# EasyEDA schematic EasyEDA_Circuit_and_PCB.json
TITLE: Charge pump detector for MACH3; REV: 1.0; Date: 2020-06-17; Sheet: 1/1; Drawn By: lukas.kaplan
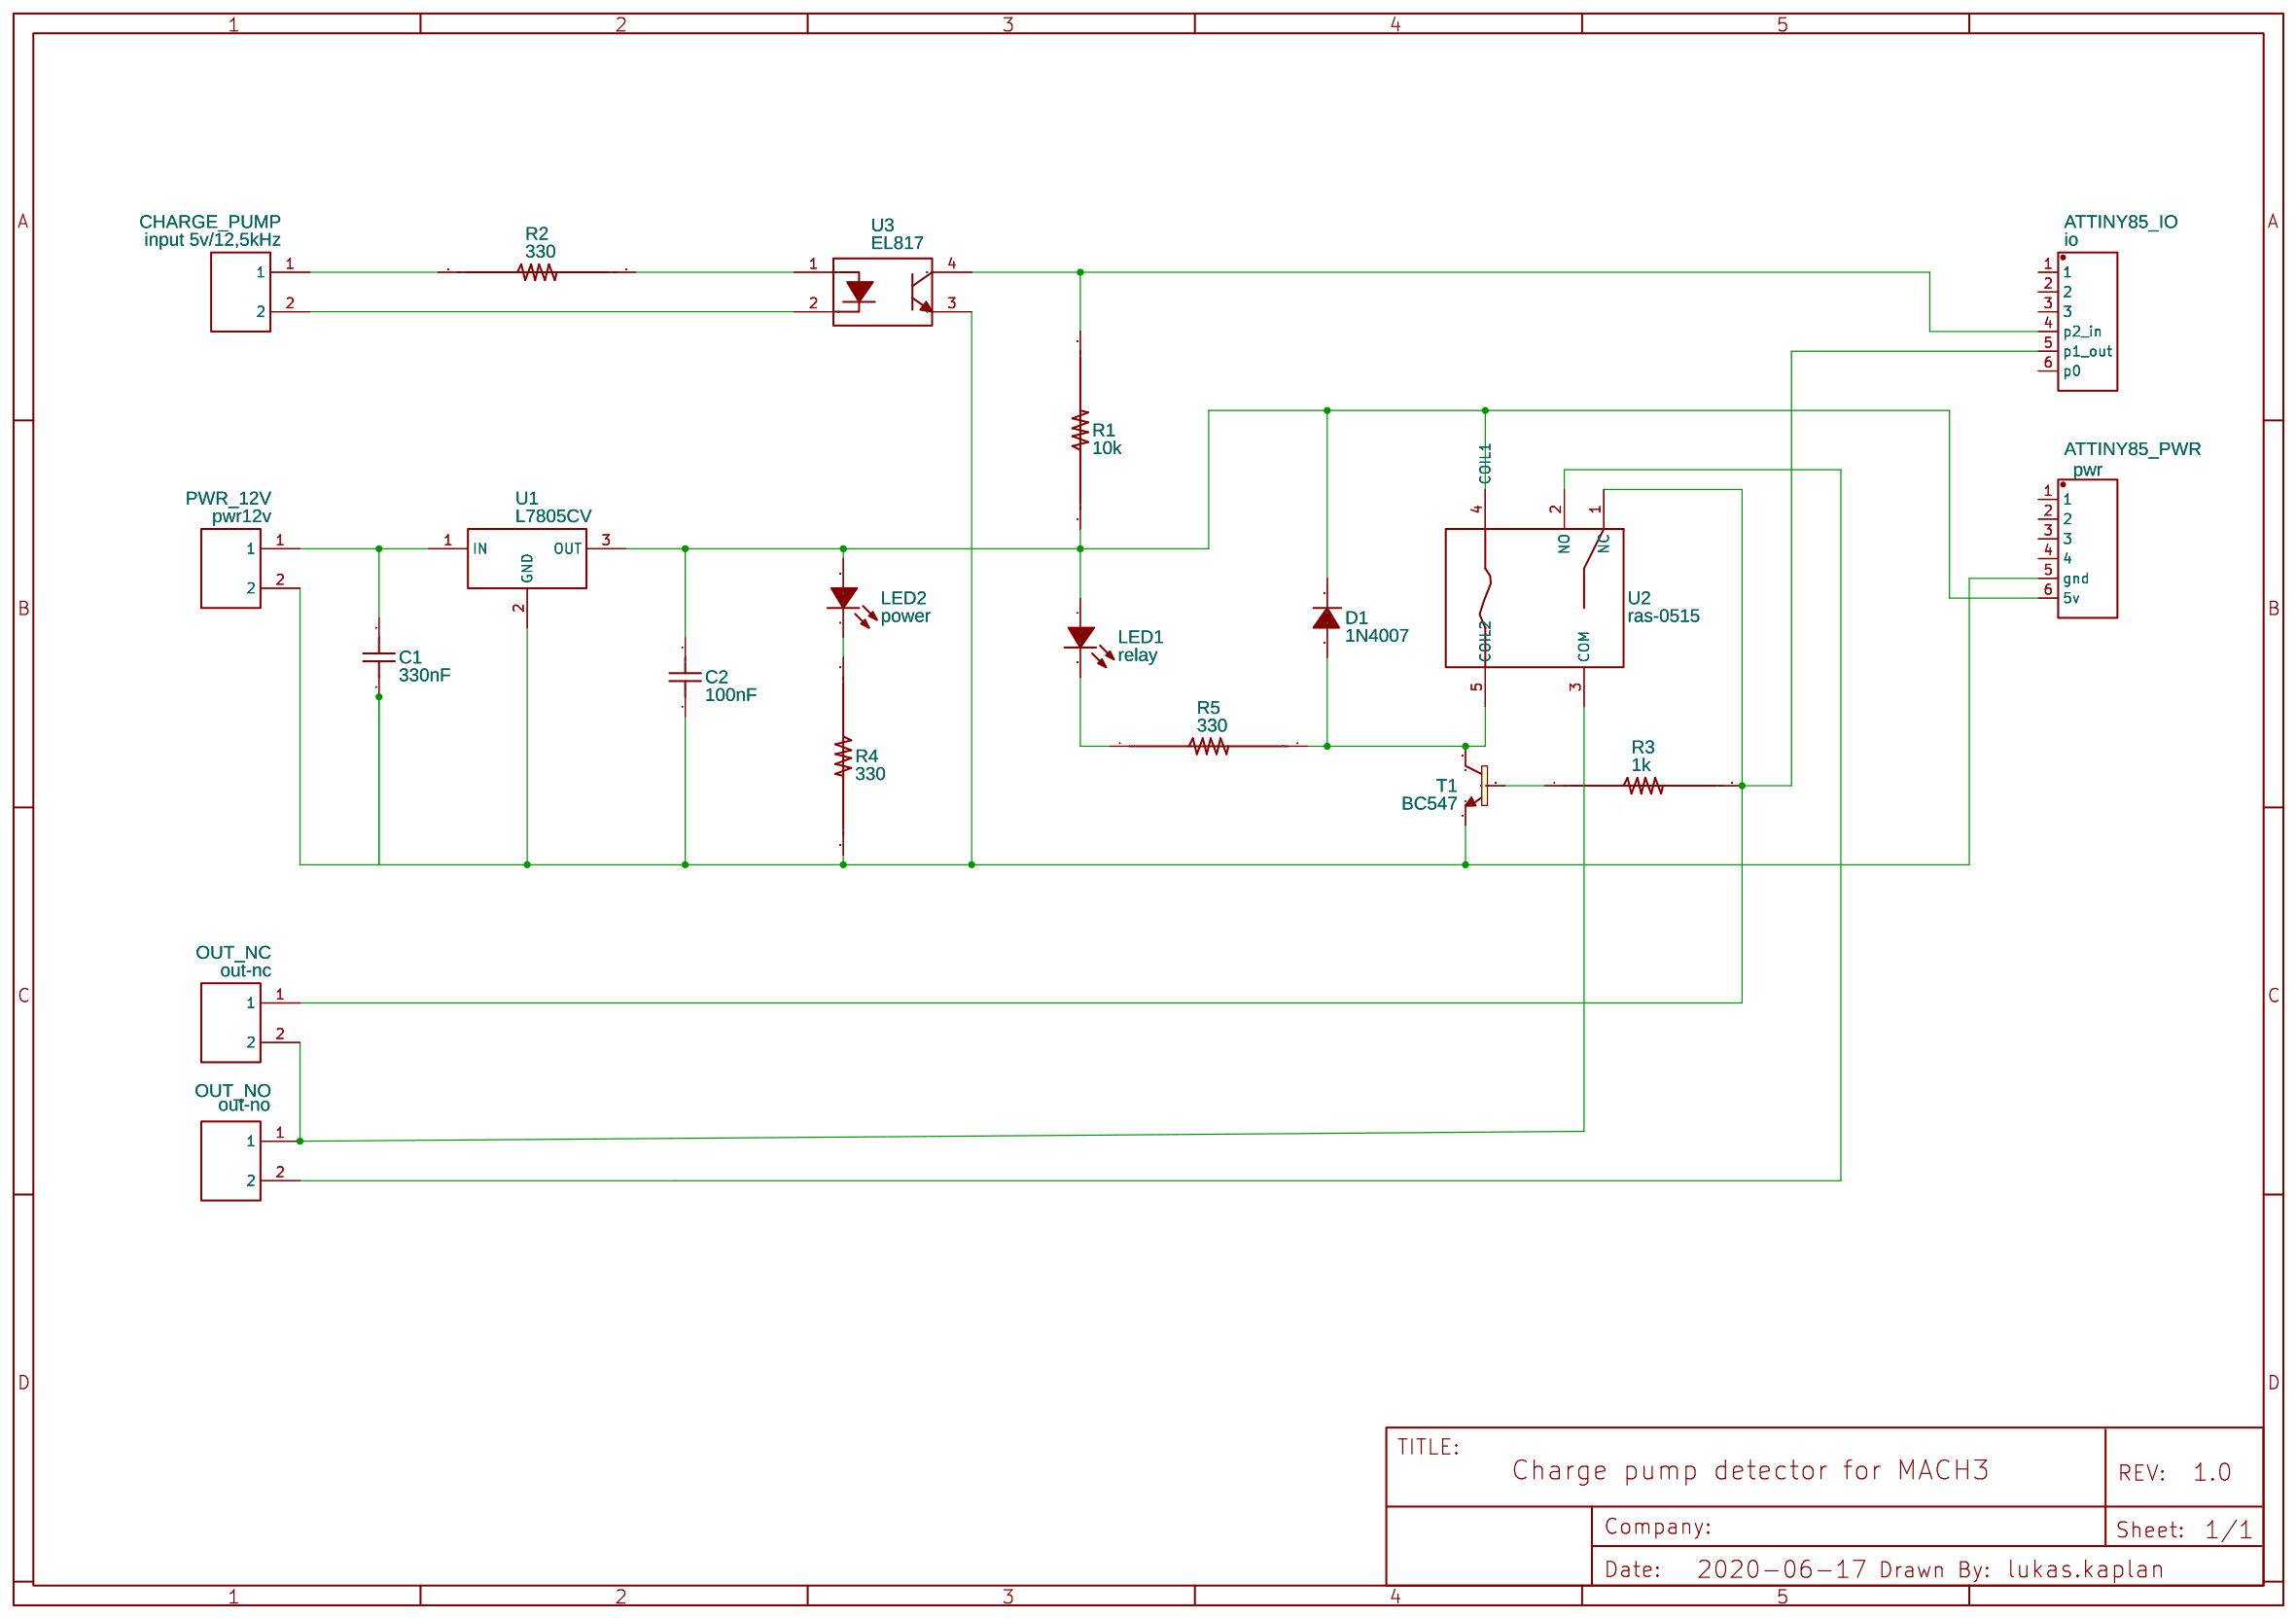
[diagram p0: schematic sheet]

## Parts
ATTINY85_IO  io  [HDR-TH_6P-P2.54-V]
ATTINY85_PWR  pwr  [HDR-TH_6P-P2.54-V]
C1  330nF  [CAP-DS-4.2*3.8]
C2  100nF  [CAP-DS-4.2*3.8]
CHARGE_PUMP  input 5v/12,5kHz  [CONN-TH_2P-P5.08_1714984]
D1  1N4007  [DO-41_BD2.4-L4.7-P8.70-D0.9-RD]
LED1  relay  [LED-TH_BD5.9-P2.54-FD]
LED2  power  [LED-TH_BD5.9-P2.54-FD]
OUT_NC  out-nc  [CONN-TH_2P-P5.08_1714984]
OUT_NO  out-no  [CONN-TH_2P-P5.08_1714984]
PWR_12V  pwr12v  [CONN-TH_2P-P5.08_1714984]
R1  10k  [AXIAL-0.3]
R2  330  [AXIAL-0.3]
R3  1k  [AXIAL-0.3]
R4  330  [AXIAL-0.3]
R5  330  [AXIAL-0.3]
T1  BC547  [TO92]
U1  L7805CV  [TO-220-3_L10.0-W4.5-P2.54-L]
U2  ras-0515  [RAS-0515A]
U3  EL817  [DIP-4_L6.4-W4.6-P2.54-LS7.6-BL]

## Library data of the parts
ATTINY85_IO = 2685Y-106CNG1SNA01: Supplier: LCSC; Supplier Part: C350307; Manufacturer: 华宇创; Manufacturer Part: 6pin; Contributor: LCSC
ATTINY85_PWR = 2685Y-106CNG1SNA01: Supplier: LCSC; Supplier Part: C350307; Manufacturer: 华宇创; Contributor: LCSC
C1 C2 = CT4-0805Y334M500: Supplier: LCSC; Manufacturer: ReliaPro; Supplier Part: C3784
CHARGE_PUMP OUT_NC OUT_NO PWR_12V = MKDSN1.5/2-5.08: Supplier: LCSC; Manufacturer: Phoenix Contact; Supplier Part: C91153
D1 = 1N4007: Supplier: LCSC; Manufacturer: SEMTECH; Supplier Part: C106903
LED1 LED2 = DY-333UYGD/SN-A3(EL): Supplier: LCSC; Supplier Part: C396995; Manufacturer: TONYU; Contributor: LCSC
R1-R5 = RESISTOR: Contributor: SparkFun
T1 = BC547: Contributor: Merlino59
U1 = L7805CV: Supplier: LCSC; Manufacturer: STMicroelectronics; Supplier Part: C111887
U2 = ras-0515: Contributor: kmark
U3 = EL817: Supplier: Comet Electronics; Manufacturer: EVERLIGHT; Manufacturer Part: EL817(C)-F; Contributor: Quanterall Electronics; Isolation: 5.0kV; link: https://store.comet.bg/Catalogue/Product/16778/

## Nets
Net-(ATTINY85_IO-4): ATTINY85_IO.4(p2 in) R1.2 U3.4(COL)
Net-(ATTINY85_IO-5): ATTINY85_IO.5(p1 out) OUT_NC.1 R3.2 U2.1(NC)
Net-(ATTINY85_PWR-5): ATTINY85_PWR.5(gnd) C1.1 C2.1 PWR_12V.2 R4.2 T1.1(E) U1.2(GND) U3.3(EM)
Net-(ATTINY85_PWR-6): ATTINY85_PWR.6(5v) C2.2 D1.1(K) LED1.1(A) LED2.1(A) R1.1 U1.3(OUT) U2.4(COIL1)
Net-(C1-2): C1.2 PWR_12V.1 U1.1(IN)
Net-(CHARGE_PUMP-1): CHARGE_PUMP.1 R2.1
Net-(CHARGE_PUMP-2): CHARGE_PUMP.2 U3.2(CAT)
Net-(D1-2): D1.2(A) R5.2 T1.3(C) U2.5(COIL2)
Net-(LED1-2): LED1.2(K) R5.1
Net-(LED2-2): LED2.2(K) R4.1
Net-(OUT_NC-2): OUT_NC.2 OUT_NO.1 U2.3(COM)
Net-(OUT_NO-2): OUT_NO.2 U2.2(NO)
Net-(R2-2): R2.2 U3.1(AN)
Net-(R3-1): R3.1 T1.2(B)

Not connected (* = marked no-connect by the designer): ATTINY85_IO 1 2 3 6(p0); ATTINY85_PWR 1 2 3 4
